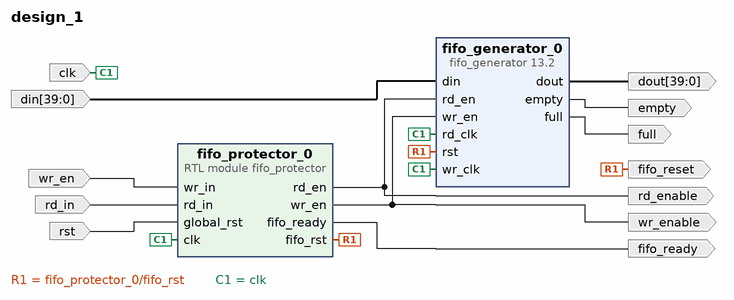
[diagram p0: block diagram of the top level]
# Vivado block design design_1, xc7a12tcpg238-2L, Vivado 2018.2
create_bd_design design_1

create_bd_port -dir I -from 39 -to 0 din
create_bd_port -dir O -from 39 -to 0 dout
create_bd_port -dir O full
create_bd_port -dir O empty
create_bd_port -dir O fifo_reset
create_bd_port -dir O rd_enable
create_bd_port -dir O wr_enable
create_bd_port -dir I clk
create_bd_port -dir I wr_en
create_bd_port -dir I rd_in
create_bd_port -dir O fifo_ready
create_bd_port -dir I rst

create_bd_cell -type ip -vlnv xilinx.com:ip:fifo_generator:13.2 fifo_generator_0
set_property -dict [list \
  CONFIG.Fifo_Implementation Independent_Clocks_Builtin_FIFO \
  CONFIG.Input_Data_Width 40 \
] [get_bd_cells fifo_generator_0]
create_bd_cell -type module -reference fifo_protector fifo_protector_0

# ---- connections ----

connect_bd_net [get_bd_ports din] [get_bd_pins fifo_generator_0/din]
connect_bd_net [get_bd_pins fifo_generator_0/dout] [get_bd_ports dout]
connect_bd_net [get_bd_pins fifo_generator_0/full] [get_bd_ports full]
connect_bd_net [get_bd_pins fifo_generator_0/empty] [get_bd_ports empty]
connect_bd_net [get_bd_pins fifo_protector_0/fifo_rst] [get_bd_ports fifo_reset] [get_bd_pins fifo_generator_0/rst]
connect_bd_net [get_bd_pins fifo_protector_0/rd_en] [get_bd_ports rd_enable] [get_bd_pins fifo_generator_0/rd_en]
connect_bd_net [get_bd_pins fifo_protector_0/wr_en] [get_bd_ports wr_enable] [get_bd_pins fifo_generator_0/wr_en]
connect_bd_net [get_bd_ports clk] [get_bd_pins fifo_generator_0/rd_clk] [get_bd_pins fifo_generator_0/wr_clk] [get_bd_pins fifo_protector_0/clk]
connect_bd_net [get_bd_ports wr_en] [get_bd_pins fifo_protector_0/wr_in]
connect_bd_net [get_bd_ports rd_in] [get_bd_pins fifo_protector_0/rd_in]
connect_bd_net [get_bd_pins fifo_protector_0/fifo_ready] [get_bd_ports fifo_ready]
connect_bd_net [get_bd_ports rst] [get_bd_pins fifo_protector_0/global_rst]

validate_bd_design
save_bd_design
